# Altium schematic sheet kr2_2.SchDoc
size 420 x 297 mm; SheetNumber: 1; SheetTotal: 1
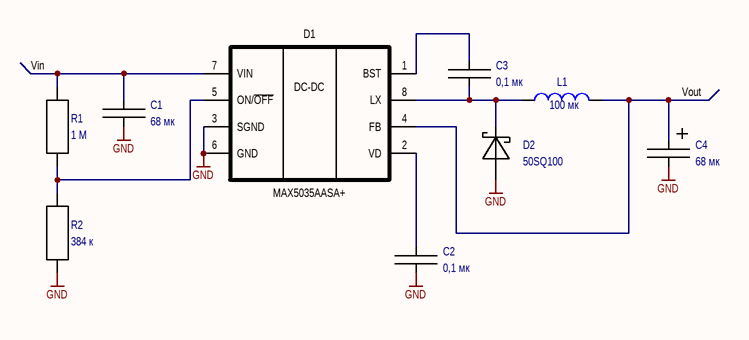
[diagram p0: kr2_2.SchDoc]

## Parts
C1  value 68 мк  (hidden comment: 68 мкФ ±* * * *, *)
C2  value 0,1 мк  (hidden comment: 0,1 мкФ ±* * * *, *)
C3  value 0,1 мк  (hidden comment: 0,1 мкФ ±* * * *, *)
C4  value 68 мк  (hidden comment: 68 мкФ ±* * * *, *)
D1  MAX5035AASA+
D2  50SQ100
L1  value 100 мк  (hidden comment: Inductor)
R1  value 1 М
R2  value 384 к

## Nets
GND: C1.1 C2.1 C4.2 D1.3(SGND) D1.6(GND) D2.1(A) R2.2
Vin: C1.2 D1.7(VIN) R1.1
Vout: C4.1 D1.4(FB) L1.2
NetC2_2: C2.2 D1.2(VD)
NetC3_1: C3.1 D1.8(LX) D2.1(C) L1.1
NetC3_2: C3.2 D1.1(BST)
NetD1_5: D1.5(ON/~{OFF}) R1.2 R2.1

## Notes on the sheet
- Перв.примен.
- Справ. №
- Подп. и дата
- Инв.№ дубл.
- Взам. инв. №
- Изм.
- Лист
- № докум.
- Подп.
- Дата
- Лит.
- Масса
- Масштаб
- Пров.
- Т.контр
- Разраб.
- Схема электрическая принципиальная
- 1
- Листов
- Инв № подл.
- Н.контр.
- Утв.
- Копировал
- Формат А3
- (in symbol MAX5035AASA+) DC-DC

## Library data of the parts
C1-C3 = C: Company: *; PartNumber: *; Tolerance: *; Voltage: *; Type: *; Package: *
C4 = C+: Company: *; Tolerance: *; Voltage: *; Type: *; PartNumber: *; Package: *
L1 = Inductor: SimulationGenericComponent: True
R1 R2 = R: Company: *; PartNumber: *; Package: *; Tolerance: *